# Altium schematic sheet SX1268.SchDoc
size A3; DocumentNumber: 1; SheetNumber: 1; SheetTotal: 2
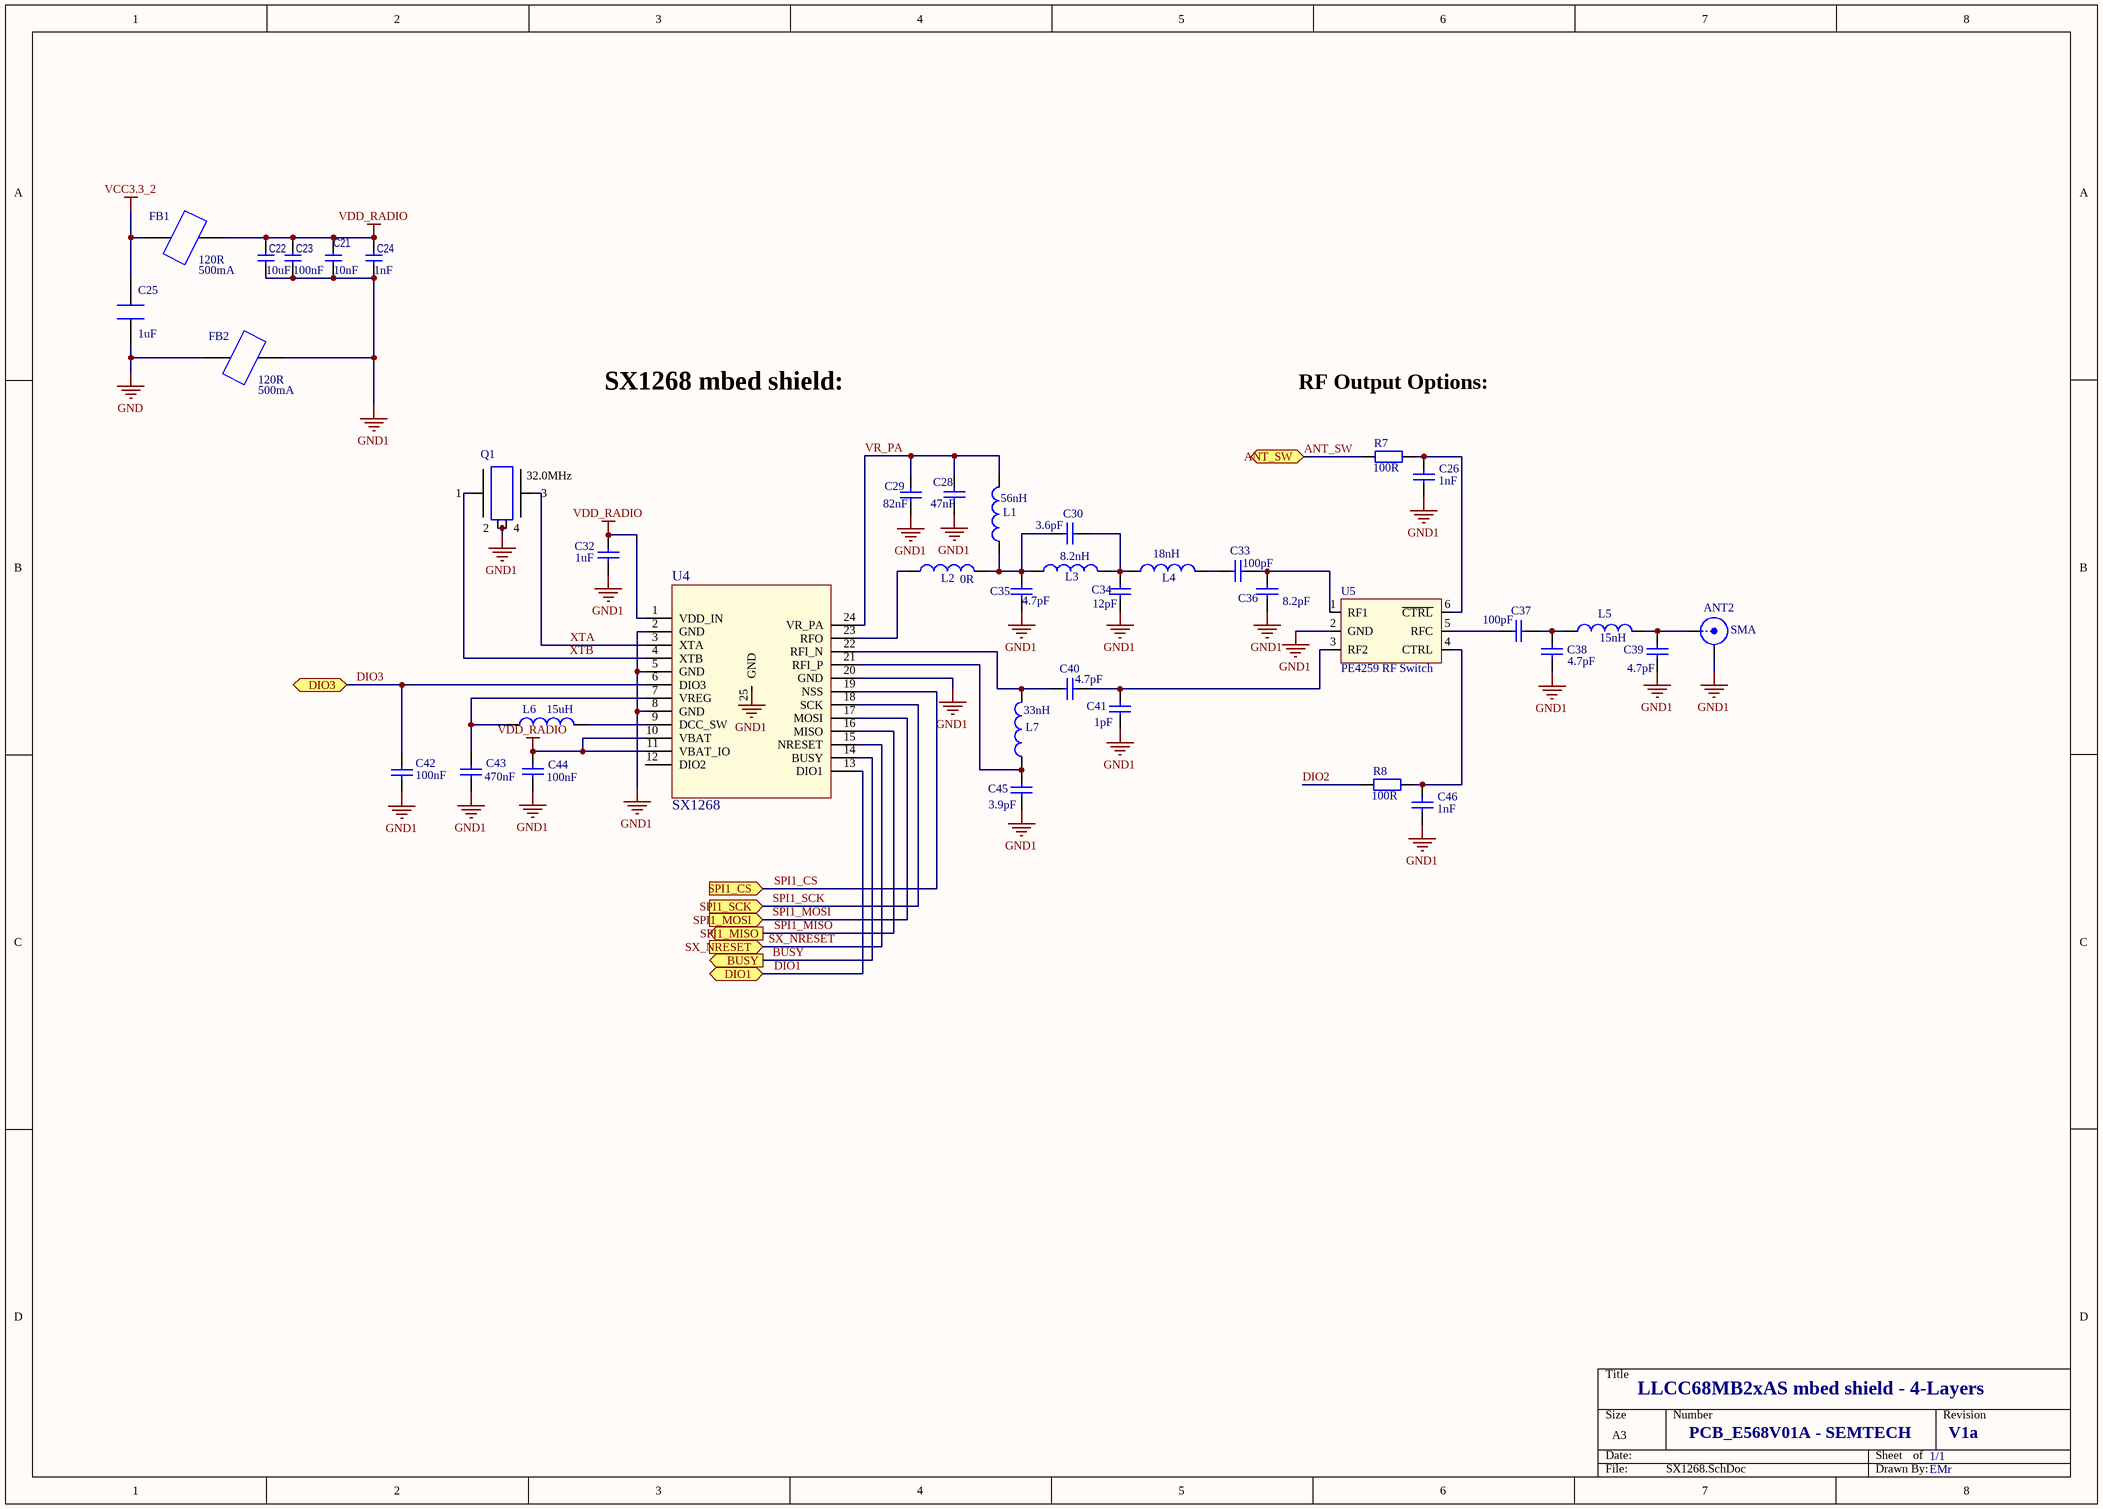
[diagram p0: SX1268.SchDoc]

## Parts
ANT2  SMA  [SMA_end_launch_1.0mm_9.52mm]
C21  10nF  [rlc_402_smd]
C22  10uF  [rlc_402_smd]
C23  100nF  [rlc_402_smd]
C24  1nF  [rlc_402_smd]
C25  1uF  [rlc_402_smd]
C26  1nF  [rlc_402_smd]
C28  47nF  [rlc_402_smd]
C29  82nF  [rlc_402_smd]
C30  3.6pF  [rlc_402_smd]
C32  1uF  [rlc_402_smd]
C33  100pF  [rlc_402_smd]
C34  12pF  [rlc_402_smd]
C35  4.7pF  [rlc_402_smd]
C36  8.2pF  [rlc_402_smd]
C37  100pF  [rlc_402_smd]
C38  4.7pF  [rlc_402_smd]
C39  4.7pF  [rlc_402_smd]
C40  4.7pF  [rlc_402_smd]
C41  1pF  [rlc_402_smd]
C42  100nF  [rlc_402_smd]
C43  470nF  [rlc_402_smd]
C44  100nF  [rlc_402_smd]
C45  3.9pF  [rlc_402_smd]
C46  1nF  [rlc_402_smd]
FB1  Rated Current: 500mA  [R0603]  (hidden comment: 120R)
FB2  Rated Current: 500mA  [R0603]  (hidden comment: 120R)
L1  56nH  [rlc_402_smd]
L2  0R  [rlc_402_smd]
L3  8.2nH  [rlc_402_smd]
L4  18nH  [rlc_402_smd]
L5  15nH  [rlc_402_smd]
L6  15uH  [rlc_805_smd enlarged]
L7  33nH  [rlc_402_smd]
Q1  value 32.0MHz  [nd2016da]  (hidden comment: 32MHz)
R7  100R  [rlc_402_smd]
R8  100R  [rlc_402_smd]
U4  SX1268  [vqfn24_4x4mm - duplicate]
U5  PE4259 RF Switch  [SC70-6]

## Ports
ANT_SW (bidir), BUSY (out), DIO1 (bidir), DIO3 (bidir), SPI1_CS (in), SPI1_MISO (out), SPI1_MOSI (in), SPI1_SCK (in), SX_NRESET (in)

## Nets
GND: C25.2(T2) FB2.1(P1)
GND1: ANT2.2(GND) C21.2 C22.2 C23.2 C24.2 C26.2 C28.1 C29.1 C32.1 C34.1 C35.1 C36.1 C38.1 C39.1 C41.1 C42.1 C43.1 C44.1 C45.1 C46.2 FB2.2(P2) Q1.2 Q1.4 U4.2(GND) U4.5(GND) U4.8(GND) U4.20(GND) U4.25(GND) U5.2(GND)
VCC3.3_2: C25.1(T1) FB1.1(P1)
VDD_RADIO: C21.1 C22.1 C23.1 C24.1 C32.2 C44.2 FB1.2(P2) U4.1(VDD_IN) U4.10(VBAT) U4.11(VBAT_IO)
ANT_SW: R7.2 ; port ANT_SW
BUSY: U4.14(BUSY) ; port BUSY
DIO1: U4.13(DIO1) ; port DIO1
DIO2: R8.2
DIO3: C42.2 U4.6(DIO3) ; port DIO3
SPI1_CS: U4.19(NSS) ; port SPI1_CS
SPI1_MISO: U4.16(MISO) ; port SPI1_MISO
SPI1_MOSI: U4.17(MOSI) ; port SPI1_MOSI
SPI1_SCK: U4.18(SCK) ; port SPI1_SCK
SX_NRESET: U4.15(NRESET) ; port SX_NRESET
VR_PA: C28.2 C29.2 L1.2 U4.24(VR_PA)
XTA: Q1.3 U4.3(XTA)
XTB: Q1.1 U4.4(XTB)
NetANT2_1: ANT2.1(Signal) C39.2 L5.2
NetC26_1: C26.1 R7.1 U5.6(~{CTRL})
NetC30_1: C30.1 C34.2 L3.2 L4.1
NetC30_2: C30.2 C35.2 L1.1 L2.2 L3.1
NetC33_1: C33.1 C36.2 U5.1(RF1)
NetC33_2: C33.2 L4.2
NetC37_1: C37.1 C38.2 L5.1
NetC37_2: C37.2 U5.5(RFC)
NetC40_1: C40.1 C41.2 U5.3(RF2)
NetC40_2: C40.2 L7.2 U4.22(RFI_N)
NetC43_2: C43.2 L6.1 U4.7(VREG)
NetC45_2: C45.2 L7.1 U4.21(RFI_P)
NetC46_1: C46.1 R8.1 U5.4(CTRL)
NetL2_1: L2.1 U4.23(RFO)
NetL6_2: L6.2 U4.9(DCC_SW)

Not connected (* = marked no-connect by the designer): U4 12(DIO2)

## Notes on the sheet
- SX1268 mbed shield:
- RF Output Options:
- LLCC68MB2xAS mbed shield - 4-Layers
- PCB_E568V01A - SEMTECH
- 1/1
- V1a
- EMr

## Library data of the parts
ANT2 = SMA: SMA Straight Connector; LatestRevisionDate: 05-oct-2007  -  Semtech; LatestRevisionNote: Re-released for DXP Platform.; Publisher: Altium Limited
C21-C24 = ProE.tmp_22p_13
  C21: Value: 10nF
  C22: Value: 10uF
  C23: Value: 100nF
  C24: Value: 1nF
C25 = E-02-0021: MLCC 4.7uF 0805 X5R 10V; Manufacturer: Murata; Manufacturer Part Number: GRM219R61A475KE34; Part Creator: JG; LEVEL: STD; DEVICE: C; FORWARD_PCB: 1; Rated Voltage (V): 10; Approx Volume Cost ($): 0.048; Approved: NO; Value: 1uF; XMOS Part Number: E-02-0021; Dielectric: X5R; Tolerance (%): 10; Datasheet: http://search.murata.co.jp/Ceramy/image/img/PDF/ENG/GRM219R61A475KE34.pdf; Max Height (mm): 0.95; Digikey Link: http://search.digikey.com/scripts/DkSearch/dksus.dll?lang=en&site=US&keywords=GRM219R61A475KE34
C26 C28-C30 C32-C46 = Cap: Capacitor SMD; Published: 8-Jun-2000; LatestRevisionDate: 05-oct-2007  -  Semtech; LatestRevisionNote: Re-released for DXP Platform.; Publisher: Altium Limited
  C26 C46: Value: 1nF
  C28: Value: 47nF
  C29: Value: 82nF
  C30: Value: 3.6pF
  C32: Value: 1uF
  C33 C37: Value: 100pF
  C34: Value: 12pF
  C35 C38-C40: Value: 4.7pF
  C36: Value: 8.2pF
  C41: Value: 1pF
  C42 C44: Value: 100nF
  C43: Value: 470nF
  C45: Value: 3.9pF
FB1 FB2 = E-08-0007: Ferrite Bead, 120R AT 100MHz, 0603, 500mA; Manufacturer: Murata; Manufacturer Part Number: BLM18AG121SN1; Part Creator: JG; LEVEL: STD; DEVICE: FB; FORWARD_PCB: 1; I_RATED: XXA; Max DC Resistance: 0.18R; Approx Volume Cost ($): 0.022; Approved: NO; Value: 120R; XMOS Part Number: E-08-0007; Datasheet: http://search.murata.co.jp/Ceramy/image/img/PDF/ENG/L0110S0100BLM18A.pdf; Max Height (mm): 0.95; Digikey Link: http://search.digikey.com/scripts/DkSearch/dksus.dll?lang=en&site=US&keywords=BLM18AG121SN1
L1-L7 = Inductor: Inductor SMD; Code_IEC: 1005; Published: 8-Jun-2000; LatestRevisionDate: 05-oct-2007  -  Semtech; LatestRevisionNote: Re-released for DXP Platform.; Publisher: Altium Limited; Code_JEITA: 0402
  L1: Value: 56nH
  L2: Value: 0R
  L3: Value: 8.2nH
  L4: Value: 18nH
  L5: Value: 15nH
  L6: Value: 15uH
  L7: Value: 33nH
Q1 = Xtal GND: Crystal with GND pins; LatestRevisionDate: 05-oct-2007  -  Semtech
R7 R8 = Resistor: Resistor SMD - IEC symbol version; LatestRevisionDate: 27-Jul-20  -  Semtech; Value: 100R
U4 = SX126x: SX1262- Ultra low power RF transceiver
U5 = PE4259 RF Switch: PE4259 Peregrine RF Switch; LatestRevisionDate: 03-Sep-2012 -  Semtech